# Altium schematic sheet Power_Diagram.SchDoc
size A4; SheetNumber: 1; SheetTotal: 2
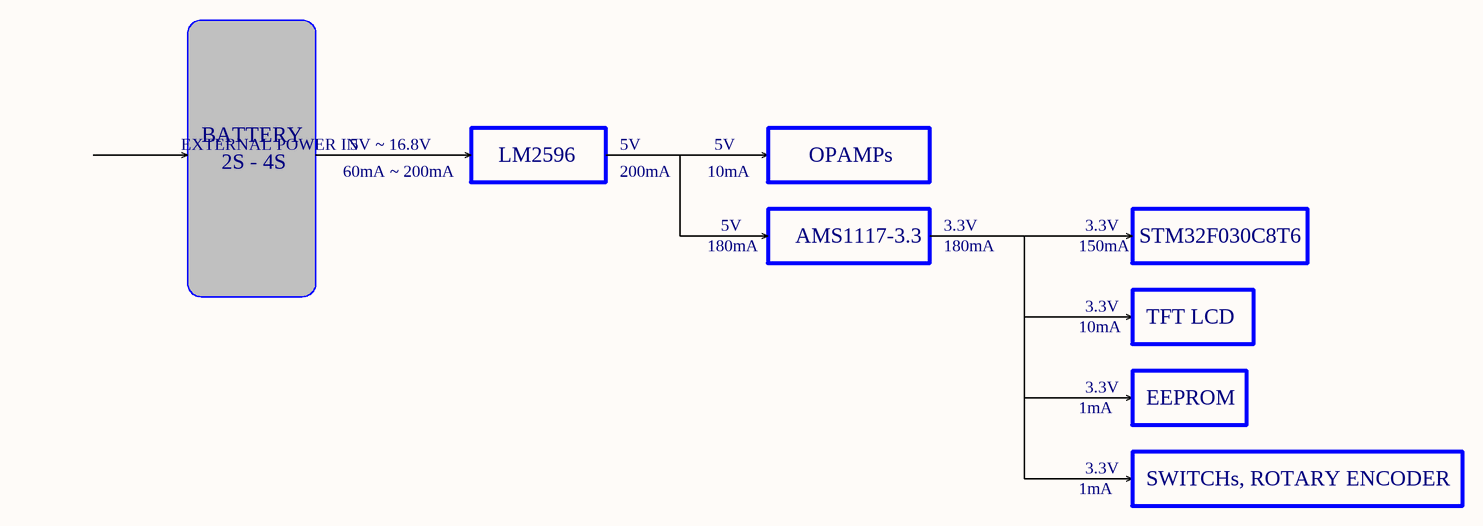
[diagram p0: Power_Diagram.SchDoc]

## Notes on the sheet
- EXTERNAL POWER IN
- BATTERY
- 2S - 4S
- 60mA ~ 200mA
- 5V ~ 16.8V
- LM2596
- 5V
- 200mA
- 10mA
- OPAMPs
- AMS1117-3.3
- 3.3V
- STM32F030C8T6
- 180mA
- 150mA
- TFT LCD
- 1mA
- EEPROM
- SWITCHs, ROTARY ENCODER